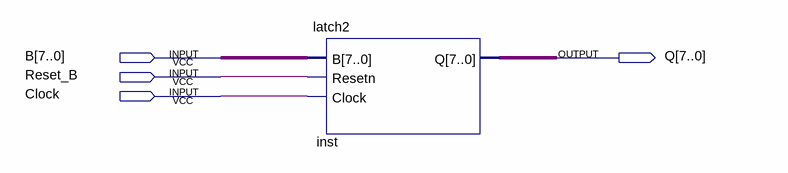
[diagram p0: schematic sheet]
// Quartus schematic individualBDF2.bdf as structural Verilog: 1 symbols, 4 pins
module individualBDF2 (
  input  [7:0] B,
  input  Reset_B,
  input  Clock,
  output [7:0] Q
);

  latch2 inst (.B(B), .Resetn(Reset_B), .Clock(Clock), .Q(Q));
endmodule
